# EAGLE design DSC Arduino Shield (EAGLE 7.5.0)
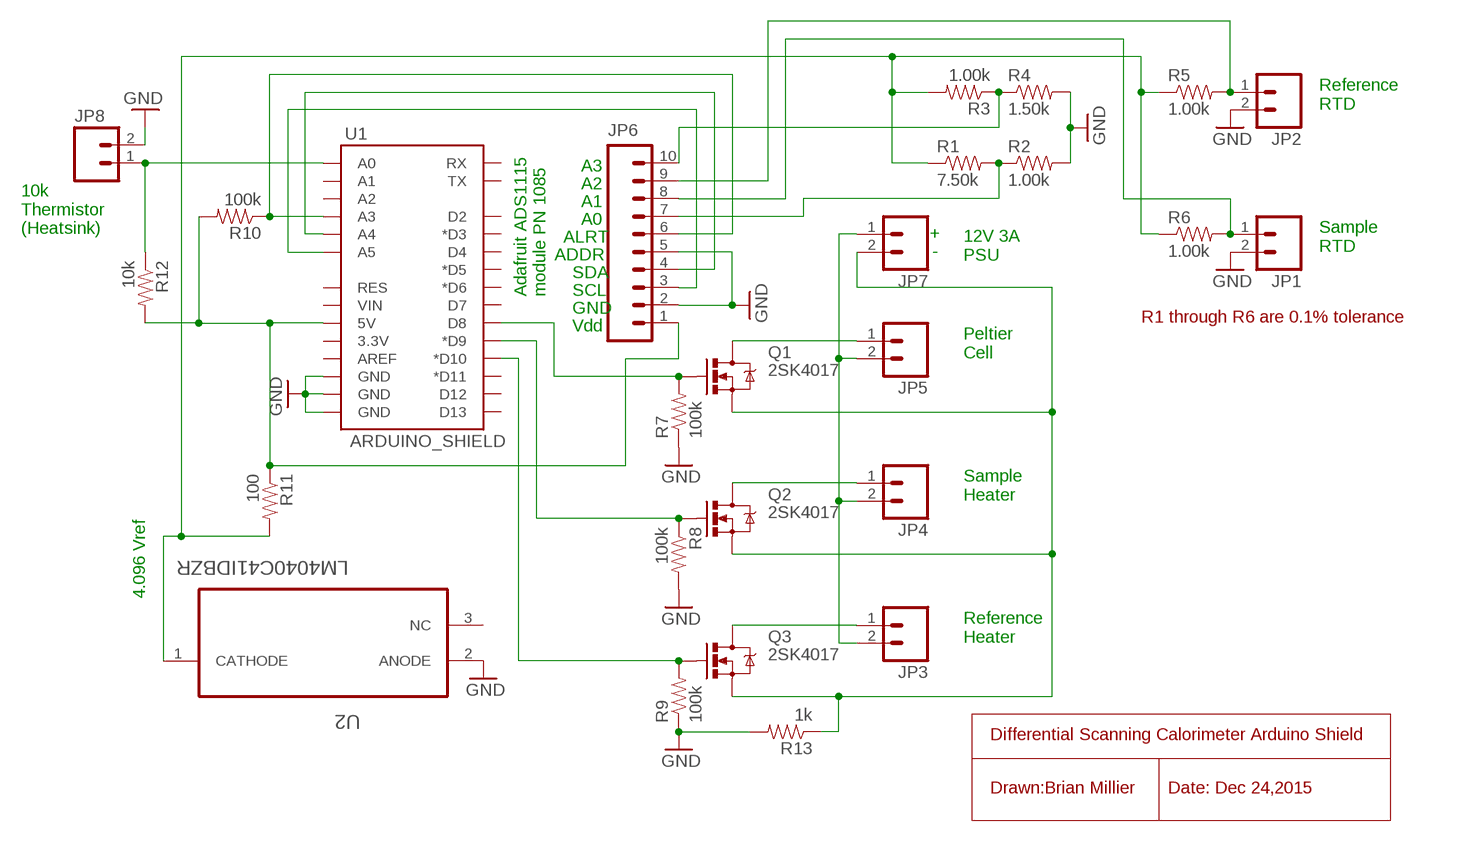
[diagram p0: schematic, sheet 1]

## Parts
JP1  M023.5MM_LOCK  [SCREWTERMINAL-3.5MM-2_LOCK]
JP2  M023.5MM_LOCK  [SCREWTERMINAL-3.5MM-2_LOCK]
JP3  M023.5MM_LOCK  [SCREWTERMINAL-3.5MM-2_LOCK]
JP4  M023.5MM_LOCK  [SCREWTERMINAL-3.5MM-2_LOCK]
JP5  M023.5MM_LOCK  [SCREWTERMINAL-3.5MM-2_LOCK]
JP6  M10SILK_FEMALE_PTH  [1X10]
JP7  M023.5MM_LOCK  [SCREWTERMINAL-3.5MM-2_LOCK]
JP8  M023.5MM_LOCK  [SCREWTERMINAL-3.5MM-2_LOCK]
Q1  2SK4017  MOSFET-NCHANNELFDD8780  [DPAK]
Q2  2SK4017  MOSFET-NCHANNELFDD8780  [DPAK]
Q3  2SK4017  MOSFET-NCHANNELFDD8780  [DPAK]
R1  7.50k  10KOHM-1/4W-1%(PTH)HORIZ  [AXIAL-0.3]
R2  1.00k  10KOHM-1/4W-1%(PTH)HORIZ  [AXIAL-0.3]
R3  1.00k  10KOHM-1/4W-1%(PTH)HORIZ  [AXIAL-0.3]
R4  1.50k  10KOHM-1/4W-1%(PTH)HORIZ  [AXIAL-0.3]
R5  1.00k  10KOHM-1/4W-1%(PTH)HORIZ  [AXIAL-0.3]
R6  1.00k  10KOHM-1/4W-1%(PTH)HORIZ  [AXIAL-0.3]
R7  100k  10KOHM-1/4W-1%(PTH)HORIZ  [AXIAL-0.3]
R8  100k  10KOHM-1/4W-1%(PTH)HORIZ  [AXIAL-0.3]
R9  100k  10KOHM-1/4W-1%(PTH)HORIZ  [AXIAL-0.3]
R10  100k  10KOHM-1/4W-1%(PTH)HORIZ  [AXIAL-0.3]
R11  100  10KOHM-1/4W-1%(PTH)HORIZ  [AXIAL-0.3]
R12  10k  10KOHM-1/4W-1%(PTH)HORIZ  [AXIAL-0.3]
R13  1k  10KOHM-1/4W-1%(PTH)HORIZ  [AXIAL-0.3]
U1  ARDUINO_SHIELD  ARDUINO_SHIELDNO_SILK  [DUEMILANOVE_VIAS]
U2  LM4040C41IDBZR  [SOT95P237X112-3N]

## Nets
GND: JP1.2 JP2.2 JP6.2 JP6.5 JP8.2 R2.P$2 R4.P$2 R7.P$1 R8.P$2 R9.P$1 R13.P$2 U1.GND@0(GND) U1.GND@1(GND) U1.GND@2(GND) U2.2(ANODE)
N$1: Q1.1(G) R7.P$2 U1.D8
N$2: Q2.1(G) R8.P$1 U1.D9(*D9)
N$3: Q3.1(G) R9.P$2 U1.D10(*D10)
N$4: JP5.1 Q1.4(D)
N$5: JP4.1 Q2.4(D)
N$6: JP3.1 Q3.4(D)
N$7: JP3.2 JP4.2 JP5.2 JP7.1
N$8: JP6.7 R1.P$2 R2.P$1
N$9: JP6.10 R3.P$1 R4.P$1
N$11: JP6.1 R10.P$2 R11.P$1 R12.P$2 U1.5V
N$12: JP7.2 Q1.3(S) Q2.3(S) Q3.3(S) R13.P$1
N$13: JP6.3 U1.A5
N$14: JP6.4 U1.A4
N$15: JP6.6 R10.P$1 U1.A3
N$16: JP2.1 JP6.9 R5.P$2
N$17: R1.P$1 R3.P$2 R5.P$1 R6.P$1 R11.P$2 U2.1(CATHODE)
N$18: JP1.1 JP6.8 R6.P$2
N$20: JP8.1 R12.P$1 U1.A0
Unconnected: U1.3.3V U1.A1 U1.A2 U1.AREF U1.D2 U1.D3(*D3) U1.D4 U1.D5(*D5) U1.D6(*D6) U1.D7 U1.D11(*D11) U1.D12 U1.D13 U1.RES U1.RX U1.TX U1.VIN U2.3(NC)

## Notes on the sheet
- Reference
  RTD
- A3
- A2
- A1
- A0
- 10k
  Thermistor
  (Heatsink)
- ALRT | +
- -
- Sample
  RTD
- ADDR
- 12V 3A
  PSU
- SDA
- Adafruit ADS1115
  module PN 1085
- SCL
- GND
- R1 through R6 are 0.1% tolerance
- Vdd
- Peltier
  Cell
- Sample
  Heater
- 4.096 Vref
- Reference
  Heater
- Differential Scanning Calorimeter Arduino Shield
- Drawn:Brian Millier | Date: Dec 24,2015

## Library data of the parts
JP1-JP5 JP7 JP8 = SparkFun-Connectors:M02: Standard 2-pin 0.1" header. Use with - straight break away headers ( PRT-00116) - right angle break away headers (PRT-00553) - swiss pins (PRT-00743) - machine pins (PRT-00117) - female headers (PRT-00115) Molex polarized connector foot print use with: PRT-08233 with associated crimp pins and housings. 2.54_SCREWTERM for use with PRT-10571. 3.5mm Screw Terminal footprints for PRT-08084 5mm Screw Terminal footprints for use with PRT-08432; PROD_ID: CONN-08399
JP6 = SparkFun-Connectors:M10: Header 10 Standard 10-pin 0.1" header. Use with straight break away headers (SKU : PRT-00116), right angle break away headers (PRT-00553), swiss pins (PRT-00743), machine pins (PRT-00117), and female headers (PRT-00115).; PROD_ID: CONN-11563
Q1-Q3 = SparkFun-DiscreteSemi:MOSFET-NCHANNEL: Common NMOSFET Parts MFG P/N Store ID Prod ID FDD8780 TRANS-09984 SI7820DN TRANS-11055 FDS6630A IC-08089 2N7002PW TRANS-11151 FQP30N06L COM-10213 TRANS-10060 BSS123LT1G TRANS-08345 BSS138 TRANS-00830 BS170 2N7000; PROD_ID: TRANS-09984
R1-R11 R13 = SparkFun-Resistors:10KOHM-1/4W-1%(PTH): RES-12183; PROD_ID: RES-12183; VALUE: 10k
R12 = SparkFun-Resistors:10KOHM-1/4W-1%(PTH): RES-12183; PROD_ID: RES-12183
U1 = SparkFun-Boards:ARDUINO_SHIELD: Arduino shield footprint
U2 = Texas Instruments_By_element14_Batch_1:LM4040C41IDBZR: PRECISION MICROPOWER SHUNT VOLTAGE REFERENCE; MPN: LM4040C41IDBZR; OC_FARNELL: 1575265; OC_NEWARK: 66K2456; PACKAGE: 3-SOT-23; SUPPLIER: TEXAS INSTRUMENTS

## Board
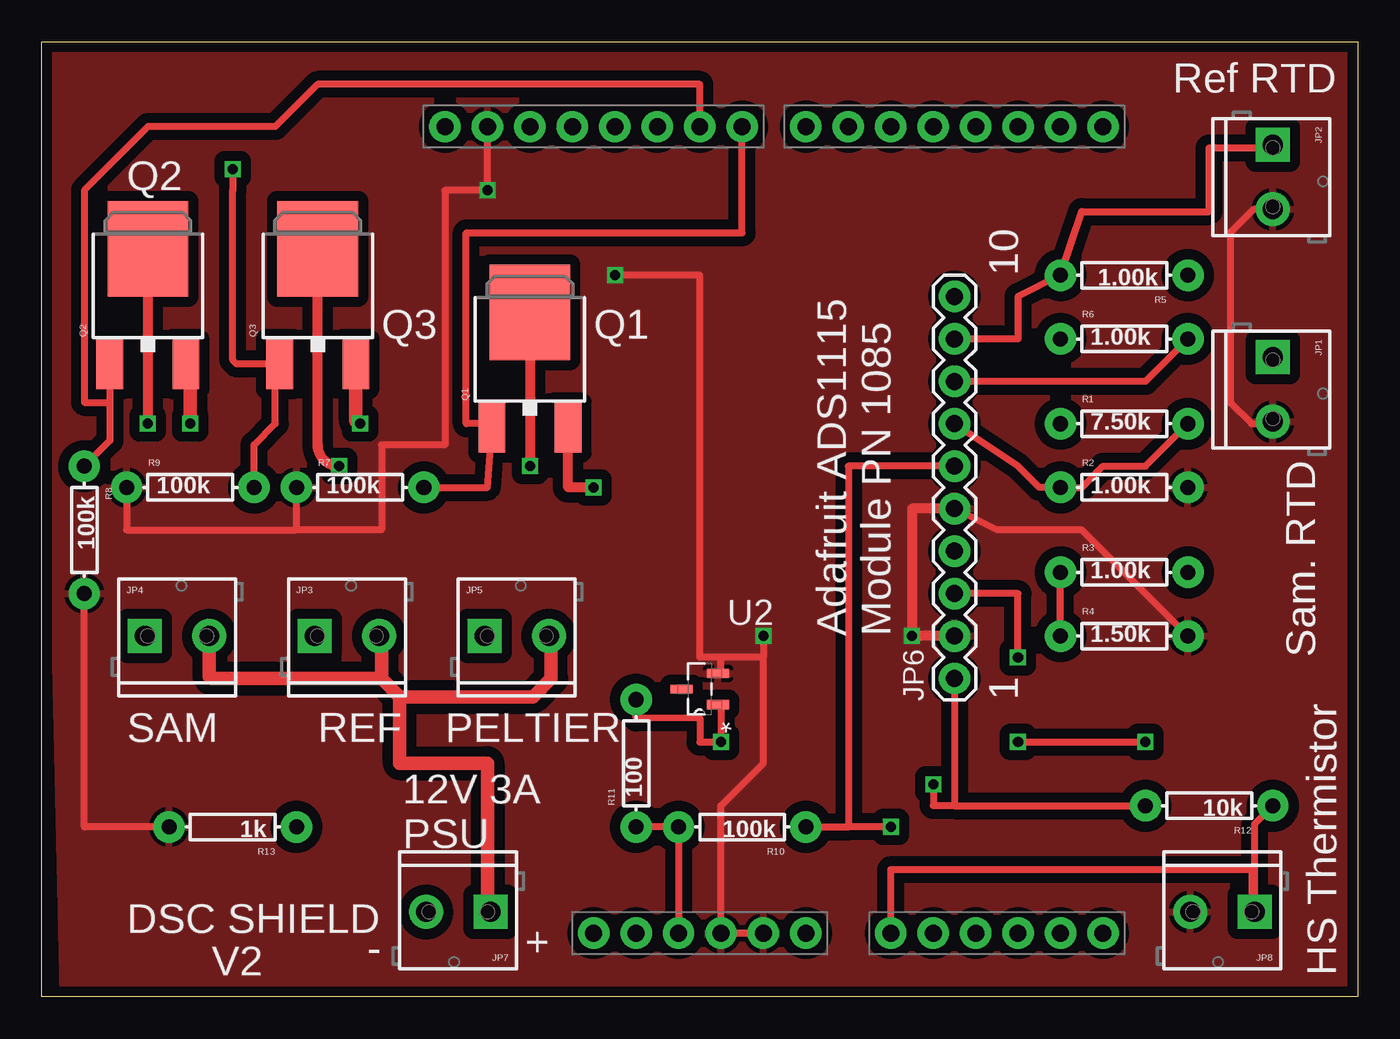
[diagram p1: board, top side]
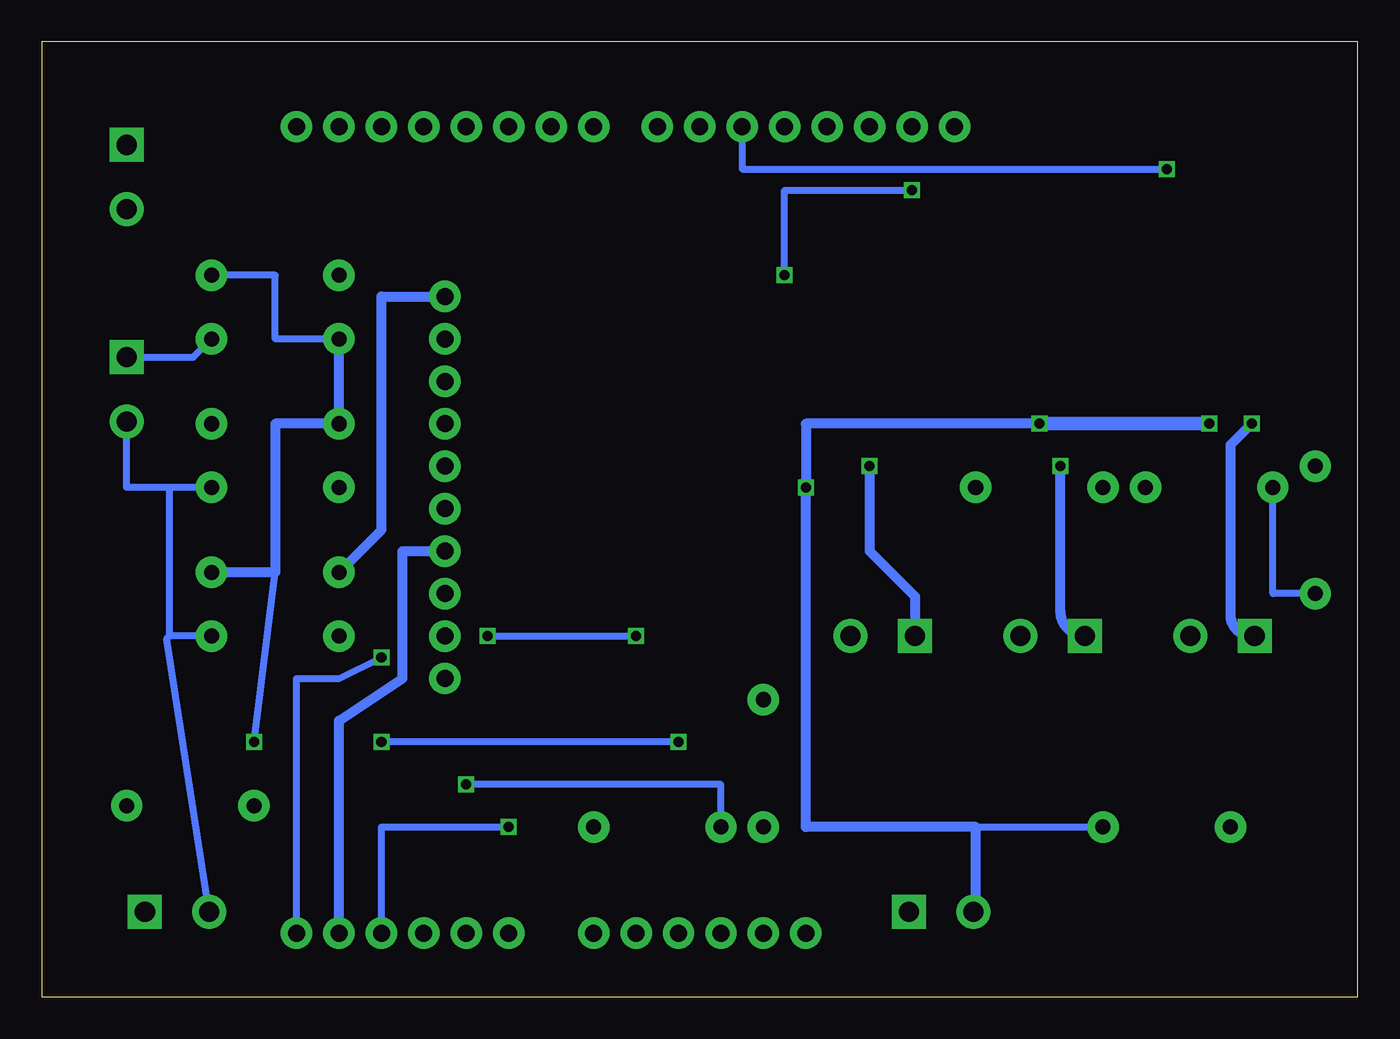
[diagram p2: board, bottom side, seen from below]

Size 78.74 x 57.15 mm. Coordinates in mm from the lower left corner, seen from the top.
Outline: 0,0 0,57.15 78.74,57.15 78.74,0 0,0
Copper layers (1*16): Top 0.0356mm / dielectric 1.5011mm / Bottom 0.0356mm
Design rules "LaenPCBOrder": minimum track width 6mil, minimum drill 13mil, track to track 6mil, track to pad 6mil, pad to pad 6mil, via to via 6mil, smd to smd 6mil, copper to edge 15mil, drill to drill 6mil, minimum pad ring 7mil, minimum via ring 7mil, stop-mask expansion 3mil, vias tented up to drill 0mil, thermal gap 10mil

### Footprints (pad centres in the part's own frame; a part is rotated, then mirrored left to right if it is on the bottom)
SCREWTERMINAL-3.5MM-2_LOCK = drill 1.2 pad 2.032 square: 1 -0.178,0 | drill 1.2 pad 2.032: 2 3.678,0
1X10 = drill 1.016 pad 1.88: 1 0,0; 2 2.54,0; 3 5.08,0; 4 7.62,0; 5 10.16,0; 6 12.7,0; 7 15.24,0; 8 17.78,0; 9 20.32,0; 10 22.86,0
DPAK = smd 1.6 x 3: 1 -2.28,-5.31; 3 2.28,-5.31 | smd 4.826 x 5.715: 4 0,1.588
AXIAL-0.3 = drill 0.9 pad 1.88: P$1 -3.81,0; P$2 3.81,0
DUEMILANOVE_VIAS = drill 1.016 pad 1.88: 3.3V 50.8,13.97; 5V 50.8,16.51; A0 50.8,29.21; A1 50.8,31.75; A2 50.8,34.29; A3 50.8,36.83; A4 50.8,39.37; A5 50.8,41.91; AREF 2.54,2.54; D2 2.54,36.83; D3 2.54,34.29; D4 2.54,31.75; D5 2.54,29.21; D6 2.54,26.67; D7 2.54,24.13; D8 2.54,20.32; D9 2.54,17.78; D10 2.54,15.24; D11 2.54,12.7; D12 2.54,10.16; D13 2.54,7.62; GND@0 50.8,19.05; GND@1 50.8,21.59; GND@2 2.54,5.08; RES 50.8,11.43; RX 2.54,41.91; TX 2.54,39.37; VIN 50.8,24.13
SOT95P237X112-3N = smd 1.321 x 0.559: 1 -1.092,0.94; 2 -1.092,-0.94 | smd 1.321 x 0.508: 3 1.092,0

### Placement (x,y rotation side)
JP1  73.66,38.1 270 top
JP2  73.66,50.8 270 top
JP3  16.51,21.59 0 top
JP4  6.35,21.59 0 top
JP5  26.67,21.59 0 top
JP6  54.61,19.05 90 top
JP7  26.67,5.08 180 top
JP8  72.39,5.08 180 top
Q1  29.21,39.37 0 top
Q2  6.35,43.18 0 top
Q3  16.51,43.18 0 top
R1  64.77,34.29 0 top
R2  64.77,30.48 0 top
R3  64.77,25.4 0 top
R4  64.77,21.59 0 top
R5  64.77,43.18 180 top
R6  64.77,39.37 0 top
R7  19.05,30.48 0 top
R8  2.54,27.94 270 top
R9  8.89,30.48 0 top
R10  41.91,10.16 180 top
R11  35.56,13.97 90 top
R12  69.85,11.43 180 top
R13  11.43,10.16 180 top
U1  21.59,54.61 270 top
U2  39.37,18.41 180 top

### Tracks (layer width: path | path; a pad name or v marks a point on that pad's centre or on a via)
GND  (via drill 0.6)
  Top 0.406: R13.P$2 2.54,10.16 R8.P$2 | R9.P$1 5.08,27.94 15.24,27.94 | 15.24,27.94 R7.P$1 | 43.18,20.32 43.18,13.97 40.64,11.43 U1.GND@0 U1.GND@1 | 43.18,20.32 40.64,20.32 | 40.64,20.32 39.37,20.32 39.37,43.18 v34.29,43.18 | v43.18,21.59 43.18,20.32 | 15.24,27.94 20.32,27.94 20.32,33.02 24.13,33.02 24.13,48.26 v26.67,48.26 U1.GND@2 | R4.P$2 62.23,27.94 57.15,27.94 JP6.5 | JP2.2 72.52,47.12 71.12,45.72 71.12,35.56 72.39,34.29 73.53,34.29 JP1.2 | U2.2 40.64,19.36 40.64,20.32
  Top 0.61: JP6.2 v52.07,21.59 52.07,29.21 JP6.5
  Bottom 0.406: R8.P$2 5.08,24.13 R9.P$1 | JP8.2 71.25,21.46 71.12,21.59 | R4.P$2 71.12,21.59 | 71.12,30.48 73.66,30.48 JP1.2 | v52.07,21.59 v43.18,21.59 | v34.29,43.18 34.29,48.26 v26.67,48.26 | R2.P$2 71.12,30.48 | 71.12,30.48 71.12,21.59
  pour Top (isolate 0.61): 1.27,0 0,57.15 78.74,57.15 80.01,0
N$1
  Top 0.406: 26.67,33.8 Q1.1 | Q1.1 arc90 26.7,34.29 25.4,34.29 25.4,45.72 41.91,45.72 U1.D8 | R7.P$2 26.67,30.48 Q1.1
N$2
  Top 0.406: Q2.1 4.07,35.56 | 4.07,35.56 4.07,33.28 R8.P$1 | U1.D9 39.37,54.61 16.51,54.61 13.97,52.07 6.35,52.07 2.54,48.26 2.54,35.56 4.07,35.56
N$3  (via drill 0.6)
  Top 0.406: R9.P$2 12.7,33.02 13.97,34.29 13.97,37.61 Q3.1 11.66,37.87 11.43,38.1 11.43,48.26 v11.43,49.53
  Bottom 0.406: U1.D10 36.83,49.53 v11.43,49.53
N$4  (via drill 0.6)
  Top 0.61: Q1.4 v29.21,31.75
  Bottom 0.61: v29.21,31.75 29.21,26.67 26.49,23.95 JP5.1
N$5  (via drill 0.6)
  Top 0.61: Q2.4 v6.35,34.29
  Bottom 0.61: JP4.1 6.35,21.59 arc90 7.62,22.86 7.62,33.02 v6.35,34.29
N$6  (via drill 0.6)
  Top 0.61: v17.78,31.75 arc-90 16.51,33.02 Q3.4
  Bottom 0.61: JP3.1 arc90 17.78,23.04 v17.78,31.75
N$7
  Top 0.406: 10.03,19.18 10.16,19.05 | 20.32,21.46 JP3.2 | 30.48,21.46 JP5.2 | 26.67,5.26 JP7.1
  Top 0.813: JP4.2 10.03,19.18 | 10.16,19.05 20.32,19.05 | 20.32,19.05 20.32,21.46 | 21.41,17.96 21.41,13.97 26.67,13.97 26.67,5.26 | 21.41,17.96 20.32,19.05 | 21.41,17.96 29.39,17.96 30.48,19.05 30.48,21.46
N$8
  Top 0.406: JP6.7 58.42,31.75 59.69,30.48 R2.P$1 62.23,30.48 63.5,31.75 66.04,31.75 R1.P$2
N$9
  Top 0.406: R4.P$1 R3.P$1
  Bottom 0.61: R3.P$1 58.42,27.94 58.42,41.91 JP6.10
N$11  (via drill 0.6)
  Top 0.406: U1.5V R10.P$2 R11.P$1 | JP6.1 54.61,11.43 | 54.61,11.43 R12.P$2 | 54.61,11.43 53.34,11.43 v53.34,12.7
  Bottom 0.406: R10.P$2 38.1,12.7 v53.34,12.7
N$12  (via drill 0.6)
  Top 0.406: 19.05,37.61 Q3.3
  Top 0.61: v33.02,30.48 31.49,30.48 Q1.3
  Top 0.813: Q2.3 arc-90 8.89,37.61 v8.89,34.29 | v19.05,34.29 arc-90 18.79,34.55 Q3.3
  Bottom 0.406: 22.86,10.16 R13.P$1
  Bottom 0.61: JP7.2 22.86,5.08 22.86,10.16 33.02,10.16 v33.02,30.48 33.02,34.29 v19.05,34.29
  Bottom 0.813: v8.89,34.29 v19.05,34.29
N$13  (via drill 0.6)
  Top 0.406: v58.42,20.32 58.42,24.13 JP6.3
  Bottom 0.406: v58.42,20.32 60.96,19.05 63.5,19.05 U1.A5
N$14
  Bottom 0.61: U1.A4 60.96,16.51 57.15,19.05 57.15,26.67 JP6.4
N$15  (via drill 0.6)
  Top 0.406: JP6.6 48.26,31.75 48.26,10.16 | R10.P$1 48.26,10.16 | v50.8,10.16 48.26,10.16
  Bottom 0.406: U1.A3 58.42,10.16 v50.8,10.16
N$16
  Top 0.406: JP2.1 73.66,50.8 69.85,50.8 69.85,46.99 62.23,46.99 R5.P$2 58.42,41.91 58.42,39.37 JP6.9
N$17  (via drill 0.6)
  Top 0.406: v58.42,15.24 v66.04,15.24 | R11.P$2 35.56,16.69 39.37,16.66 39.37,15.24 v40.64,15.24 40.64,17.48 U2.1
  Bottom 0.406: v40.64,15.24 v58.42,15.24 | v66.04,15.24 64.77,25.4 | R6.P$1 64.77,39.37 64.77,43.18 R5.P$1
  Bottom 0.61: R6.P$1 R1.P$1 64.77,34.29 64.77,25.4 R3.P$2
N$18
  Top 0.406: R6.P$2 66.04,36.83 JP6.8
  Bottom 0.406: JP1.1 69.67,38.28 R6.P$2
N$20
  Top 0.406: 72.39,7.62 72.39,5.26 JP8.1 72.57,7.62 | 72.57,7.62 72.57,10.34 R12.P$1 | U1.A0 50.8,7.62 72.57,7.62

### Text on the board
tPlace: Ref RTD | 10 | Adafruit ADS1115 / Module PN 1085 | Sam. RTD | 1 | SAM | REF | PELTIER | 12V 3A / PSU | DSC SHIELD | - | + | V2 | HS Thermistor
tNames: Q2 | Q3 | Q1